# Altium schematic sheet FlowRateSensor1.SchDoc
size A4; SheetNumber: 9; SheetTotal: 11
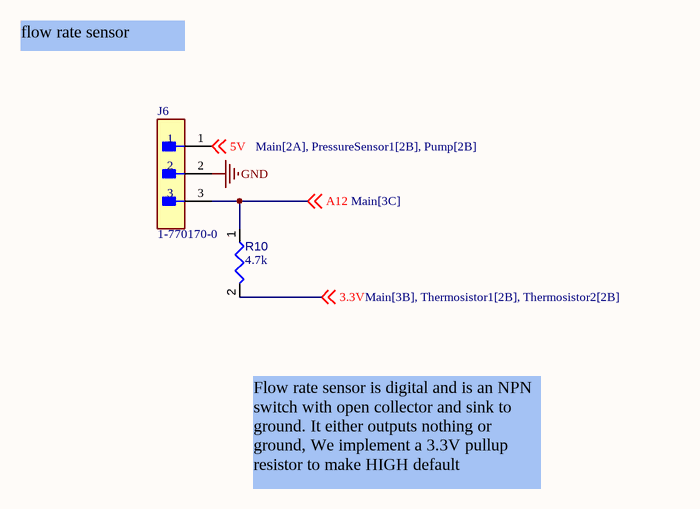
[diagram p0: FlowRateSensor1.SchDoc]

## Parts
J6  1-770170-0  [FP-1-770170-0-MFG]
R10  value 4.7k  [RESC1005X40X25ML05T05]  (hidden comment: Resistor 4k7 +/-1% 0402 100 mW)

## Nets
GND: J6.2
3.3V: R10.2 ; off-sheet 3.3V
5V: J6.1 ; off-sheet 5V
A12: J6.3 R10.1 ; off-sheet A12

## Notes on the sheet
- flow rate sensor
- Flow rate sensor is digital and is an NPN switch with open collector and sink to ground. It either outputs nothing or ground, We implement a 3.3V pullup resistor to make HIGH default

## Library data of the parts
J6 = CMP-03369-000023-1: CONN HEADER VERT 3POS 4.14MM; Manufacturer: TE Connectivity; Voltage Rating: 600V; Standoff Height: 0.63mm; Conn Gender: Male; Number Of Contacts: 3; Conn Orientation: Vertical; Current Rating: 9.5A; Temperature Range Low: -55°C; Device Class L3: unset; Temperature Range High: +105°C; Octopart: https://octopart.com/1-770170-0-te+connectivity-46505214; Mouser Description: Pin & Socket Connectors HEADER 3 POS TIN IN LINE; Package: 1-770170-0; Pitch: 4.14mm; ComponentLink2Description: Datasheet; Category: Conn; Number Of Rows: 1; Device Class L1: Connectors; Height: 14.51mm; Contact Material: Gold,Nickel; Digikey Description: CONN HEADER VERT 3POS 4.14MM; ComponentLink2URL: https://www.te.com/commerce/DocumentDelivery/DDEController?Action=showdoc&DocId=Customer+Drawing%7F770170%7FM2%7Fpdf%7FEnglish%7FENG_CD_770170_M2.pdf%7F1-770170-0; Automotive: No; Temperature: -55°C to +105°C; Manufacturer Part Number: 1-770170-0; Lead Free: Yes; Device Class L2: Headers and Wire Housings; RoHS: TRUE
R10 = CMP-009-00030-5: Chip Resistor, 4.7 KOhm, +/- 1%, 0.1 W, -55 to 155 degC, 0402 (1005 Metric); Power: 100mW; Voltage Rating: 50V; Mounting Technology: SM; RoHS Compliant: True; Tolerance: 1%; Min Operating Temperature: -55°C; Max Operating Temperature: 155°C; Case/Package: 0402; Pins: 2